# EAGLE design Adafruit MiniPOV4 Kit (EAGLE 6.3)
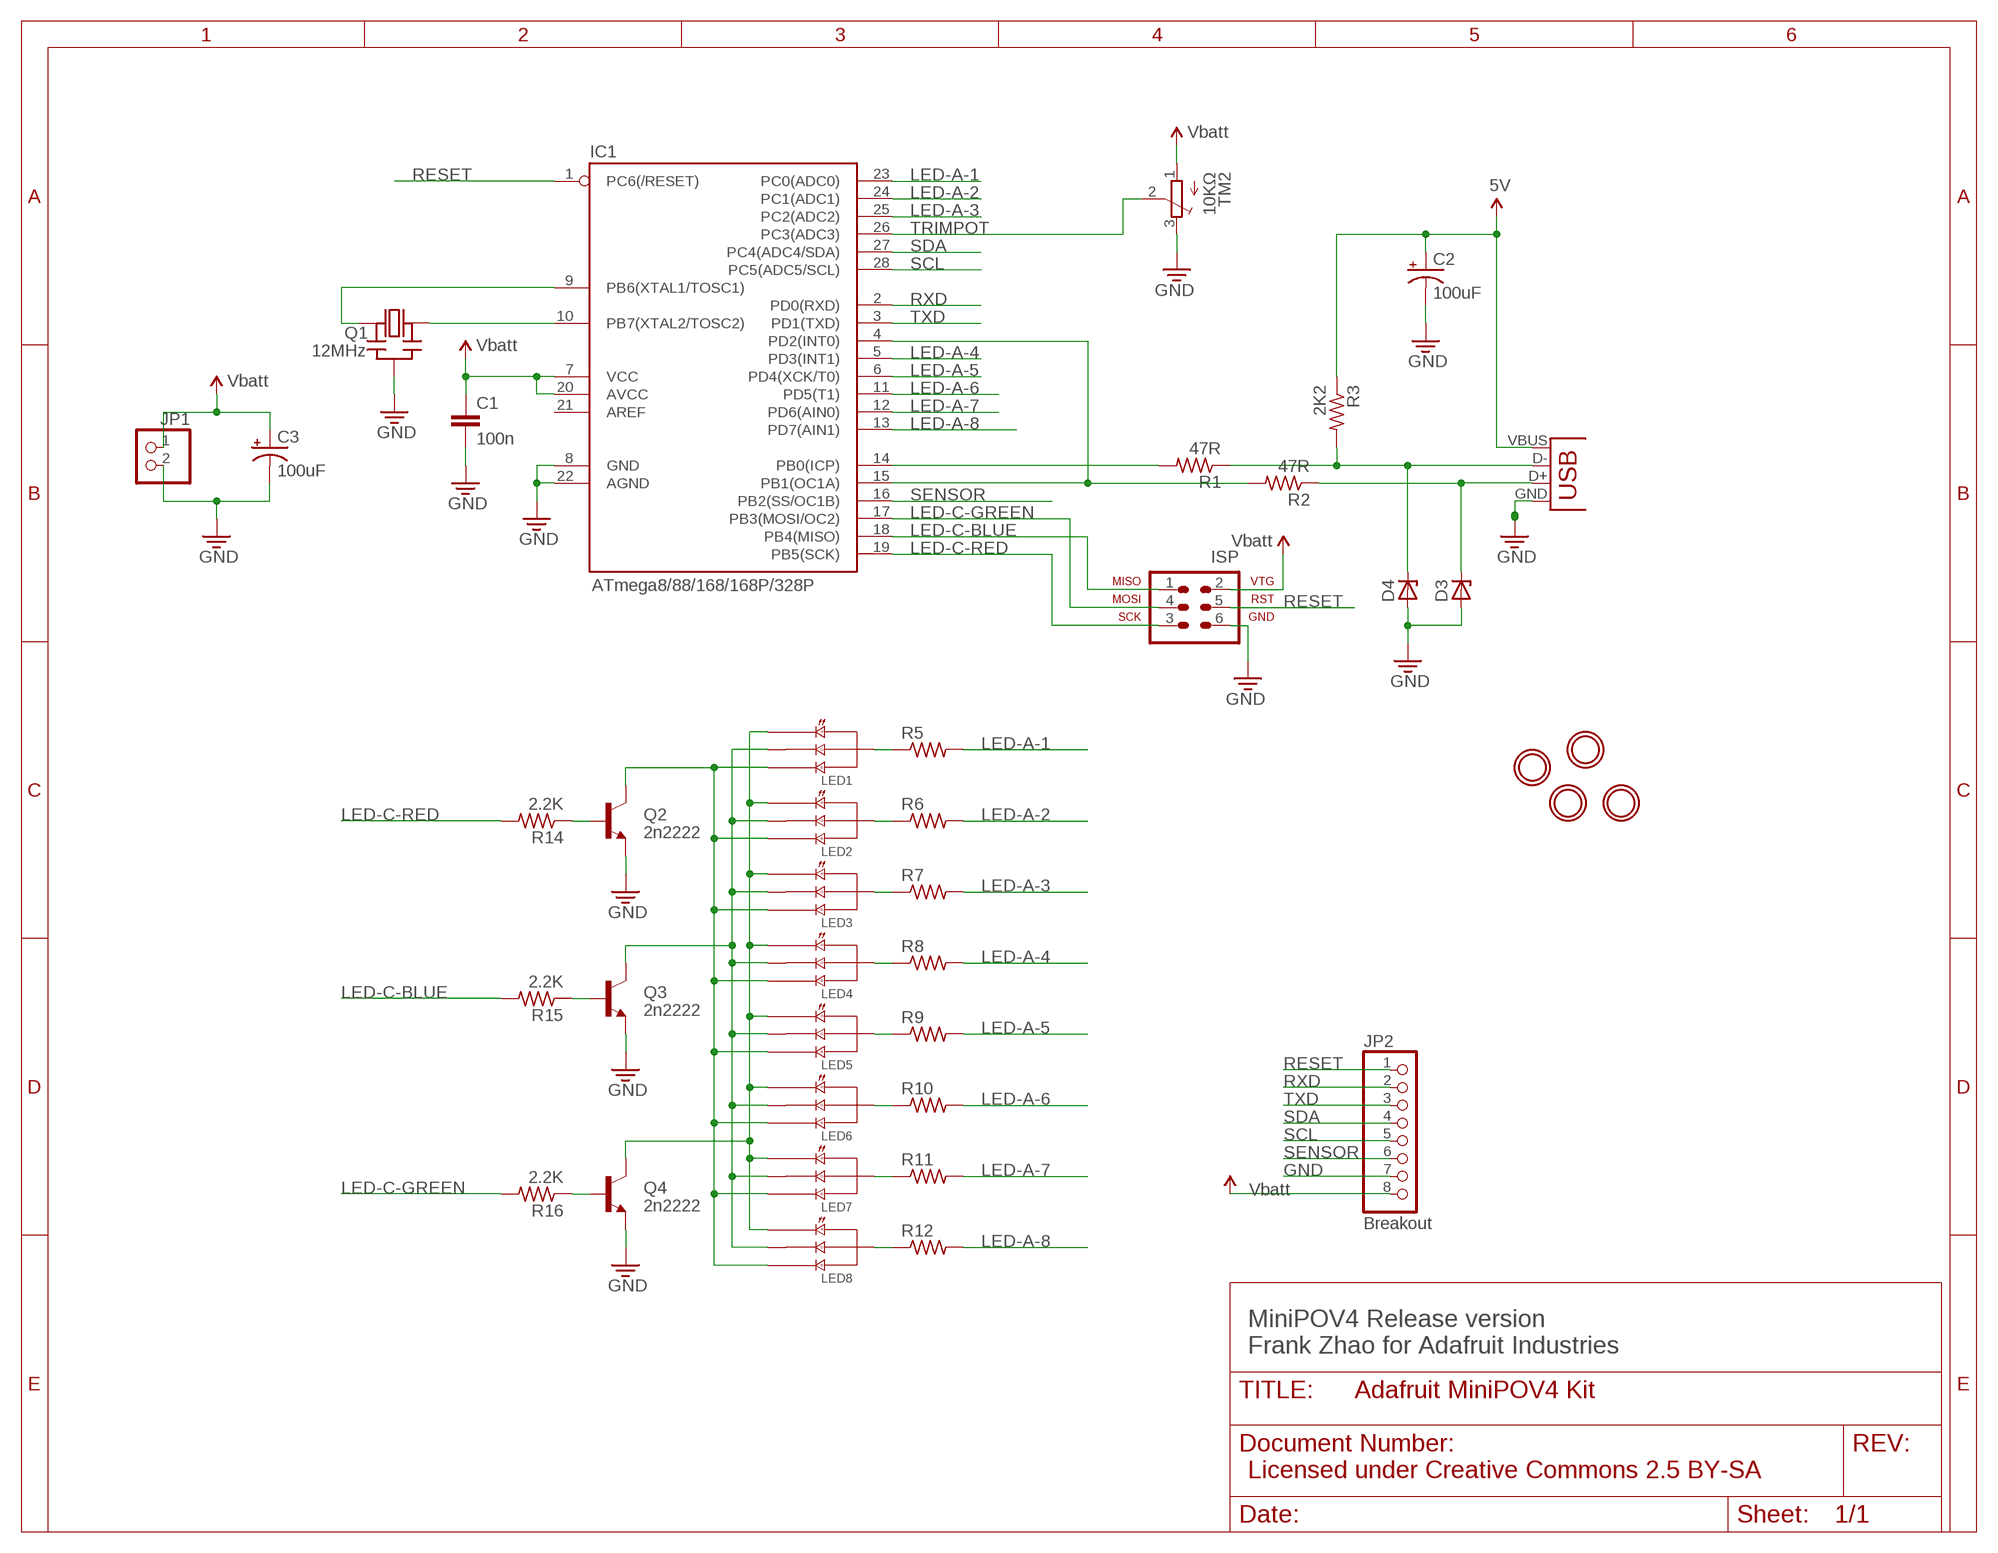
[diagram p0: schematic, sheet 1]

## Parts
C1  100n  CAPPTH2  [CAP-PTH-SMALL2]
C2  100uF  CPOL-USE2.5-6  [E2,5-6]
C3  100uF  CPOL-USE2.5-6  [E2,5-6]
D3  ZENER-DIODEDO34-7  [DO34Z7]
D4  ZENER-DIODEDO34-7  [DO34Z7]
IC1  ATmega8/88/168/168P/328P  AVR-MEGA8-PPTH  [DIL28-3]
ISP  AVR-ISP-6  [AVR-ISP-6]
JP1  HEADER-1X2  [1X02_OVAL]
JP2  Breakout  PINHD-1X8BIG  [1X08-BIG]
LED1  LED-RGB-CA-PIRANHA  [PIRANHA5MM]
LED2  LED-RGB-CA-PIRANHA  [PIRANHA5MM]
LED3  LED-RGB-CA-PIRANHA  [PIRANHA5MM]
LED4  LED-RGB-CA-PIRANHA  [PIRANHA5MM]
LED5  LED-RGB-CA-PIRANHA  [PIRANHA5MM]
LED6  LED-RGB-CA-PIRANHA  [PIRANHA5MM]
LED7  LED-RGB-CA-PIRANHA  [PIRANHA5MM]
LED8  LED-RGB-CA-PIRANHA  [PIRANHA5MM]
Q1  12MHz  CERMOSCILL  [CERM_OSC]
Q2  2n2222  TRANSISTOR_NPNTO92  [TO-92]
Q3  2n2222  TRANSISTOR_NPNTO92  [TO-92]
Q4  2n2222  TRANSISTOR_NPNTO92  [TO-92]
R1  47R  R-US_0207/9  [0207/9]
R2  47R  R-US_0207/9  [0207/9]
R3  2K2  R-US_0207/9  [0207/9]
R5  R-US_0207/9  [0207/9]
R6  R-US_0207/9  [0207/9]
R7  R-US_0207/9  [0207/9]
R8  R-US_0207/9  [0207/9]
R9  R-US_0207/9  [0207/9]
R10  R-US_0207/9  [0207/9]
R11  R-US_0207/9  [0207/9]
R12  R-US_0207/9  [0207/9]
R14  2.2K  R-US_0207/9  [0207/9]
R15  2.2K  R-US_0207/9  [0207/9]
R16  2.2K  R-US_0207/9  [0207/9]
TM2  10KΩ  TRIMPOT3386  [TRIM-3386]
U$2  MOUNTINGHOLE2.5_THICK  [MOUNTINGHOLE_2.5_PLATED_THICK]
U$3  MOUNTINGHOLE2.5_THICK  [MOUNTINGHOLE_2.5_PLATED_THICK]
U$4  MOUNTINGHOLE2.5_THICK  [MOUNTINGHOLE_2.5_PLATED_THICK]
U$5  MOUNTINGHOLE2.5_THICK  [MOUNTINGHOLE_2.5_PLATED_THICK]
USB  USBPTH  [USB-B-PTH]

## Nets
3.3V: C1.1 C3.+ IC1.7(VCC) IC1.20(AVCC) ISP.2(VTG) JP1.1 JP2.8 TM2.1(A) ; supply symbol labelled Vbatt
5V: C2.+ R3.1 USB.VBUS
GND: C1.2 C2.- C3.- D3.A D4.A IC1.8(GND) IC1.22(AGND) ISP.6(GND) JP1.2 JP2.7 Q1.G(GND) Q2.1(E) Q3.1(E) Q4.1(E) TM2.3(E) USB.GND USB.S1 USB.S2
LED-A-1: IC1.23(PC0(ADC0)) R5.2
LED-A-2: IC1.24(PC1(ADC1)) R6.2
LED-A-3: IC1.25(PC2(ADC2)) R7.2
LED-A-4: IC1.5(PD3(INT1)) R8.2
LED-A-5: IC1.6(PD4(XCK/T0)) R9.2
LED-A-6: IC1.11(PD5(T1)) R10.2
LED-A-7: IC1.12(PD6(AIN0)) R11.2
LED-A-8: IC1.13(PD7(AIN1)) R12.2
LED-C-BLUE: IC1.18(PB4(MISO)) ISP.1(MISO) R15.2
LED-C-GREEN: IC1.17(PB3(MOSI/OC2)) ISP.4(MOSI) R16.2
LED-C-RED: IC1.19(PB5(SCK)) ISP.3(SCK) R14.2
N$1: IC1.9(PB6(XTAL1/TOSC1)) Q1.1(IN)
N$2: IC1.10(PB7(XTAL2/TOSC2)) Q1.2(OUT)
N$3: D4.C R1.1 R3.2 USB.D-
N$4: D3.C R2.1 USB.D+
N$5: LED2.4(C) R6.1
N$6: LED1.4(C) R5.1
N$7: IC1.14(PB0(ICP)) R1.2
N$8: IC1.4(PD2(INT0)) IC1.15(PB1(OC1A)) R2.2
N$10: LED8.4(C) R12.1
N$11: LED7.4(C) R11.1
N$12: LED6.4(C) R10.1
N$13: LED5.4(C) R9.1
N$14: LED4.4(C) R8.1
N$15: LED3.4(C) R7.1
N$16: LED1.2(R) LED2.2(R) LED3.2(R) LED4.2(R) LED5.2(R) LED6.2(R) LED7.2(R) LED8.2(R) Q4.3(C)
N$17: LED1.3(G) LED2.3(G) LED3.3(G) LED4.3(G) LED5.3(G) LED6.3(G) LED7.3(G) LED8.3(G) Q3.3(C)
N$18: LED1.1(B) LED2.1(B) LED3.1(B) LED4.1(B) LED5.1(B) LED6.1(B) LED7.1(B) LED8.1(B) Q2.3(C)
N$19: Q2.2(B) R14.1
N$20: Q3.2(B) R15.1
N$21: Q4.2(B) R16.1
RESET: IC1.1(PC6(/RESET)) ISP.5(RST) JP2.1
RXD: IC1.2(PD0(RXD)) JP2.2
SCL: IC1.28(PC5(ADC5/SCL)) JP2.5
SDA: IC1.27(PC4(ADC4/SDA)) JP2.4
SENSOR: IC1.16(PB2(SS/OC1B)) JP2.6
TRIMPOT: IC1.26(PC3(ADC3)) TM2.2(S)
TXD: IC1.3(PD1(TXD)) JP2.3
Unconnected: IC1.21(AREF)

## Notes on the sheet
- MiniPOV4 Release version
  Frank Zhao for Adafruit Industries
- Licensed under Creative Commons 2.5 BY-SA

## Library data of the parts
C1 = minipov4:CAP: Capacitor Standard 0603 ceramic capacitor, and 0.1" leaded capacitor.
C2 C3 = rcl-ez:CPOL-US: POLARIZED CAPACITOR, American symbol
D3 D4 = diode:ZENER-DIODE: Z-Diode
IC1 = minipov4:AVR-MEGA8-P: MICROCONTROLLER 8 Kbytes FLASH 1 kbytes SRAM 512 bytes EEPROM USART 4-channel 10 bit ADC 2-channel 8 bit ADC
ISP = minipov4:AVR-ISP-6: AVR ISP-6 Serial Programming Header
JP1 = microbuilder:HEADER-1X2: PIN HEADER
JP2 = adafruit:PINHD-1X8: PIN HEADER
LED1-LED8 = minipov4:LED-RGB-CA
Q1 = minipov4:CERMOSCILL
Q2-Q4 = minipov4:TRANSISTOR_NPN: Transistor NPN BJT configuration in SOT23 package. MMBT2222 is the common NPN we use. Double check BCE configuration again layout.
R1-R3 R5-R12 R14-R16 = adafruit:R-US_: RESISTOR, American symbol
TM2 = adafruit:TRIMPOT: SMT trimmer potentiometer part number TC33X http://www.ladyada.net/library/eagle
U$2-U$5 = microbuilder:MOUNTINGHOLE: Mounting Hole For #2 screws (0.086"/2.18mm width, 0.094"/2.4mm hole) use 2.5mm
USB = minipov4:USB: USB Connectors USB-B-PTH is fully proven SKU : PRT-00139 USB-miniB is fully proven SKU : PRT-00587 USB-A-PCB is untested. USB-A-H is throughly reviewed, but untested. Spark Fun Electronics SKU : PRT-00437 USB-B-SMT is throughly reviewed, but untested. Needs silkscreen touching up. USB-A-S has not been used/tested USB-MB-H has not been used/tested

## Board
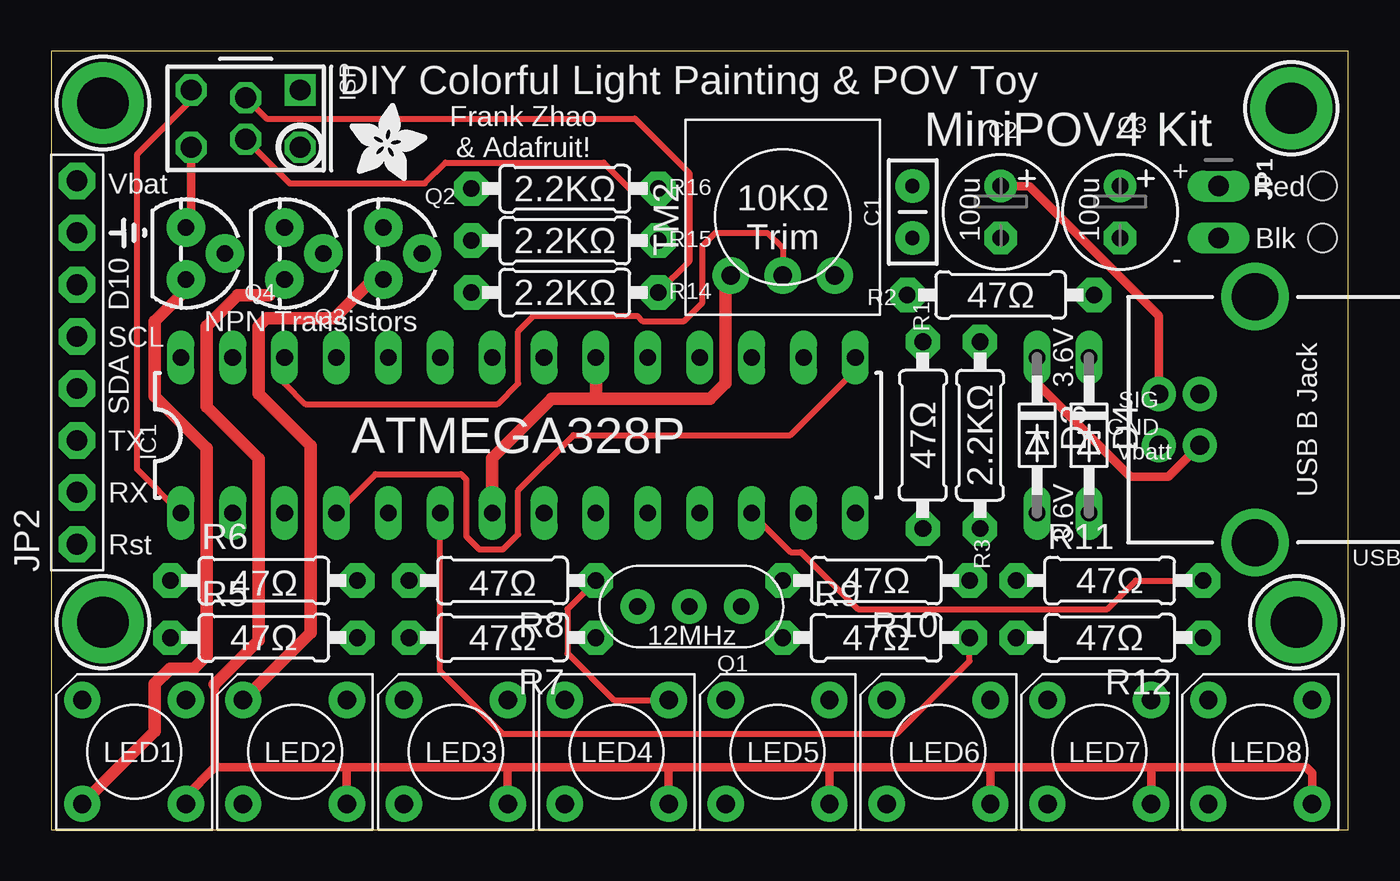
[diagram p1: board, top side]
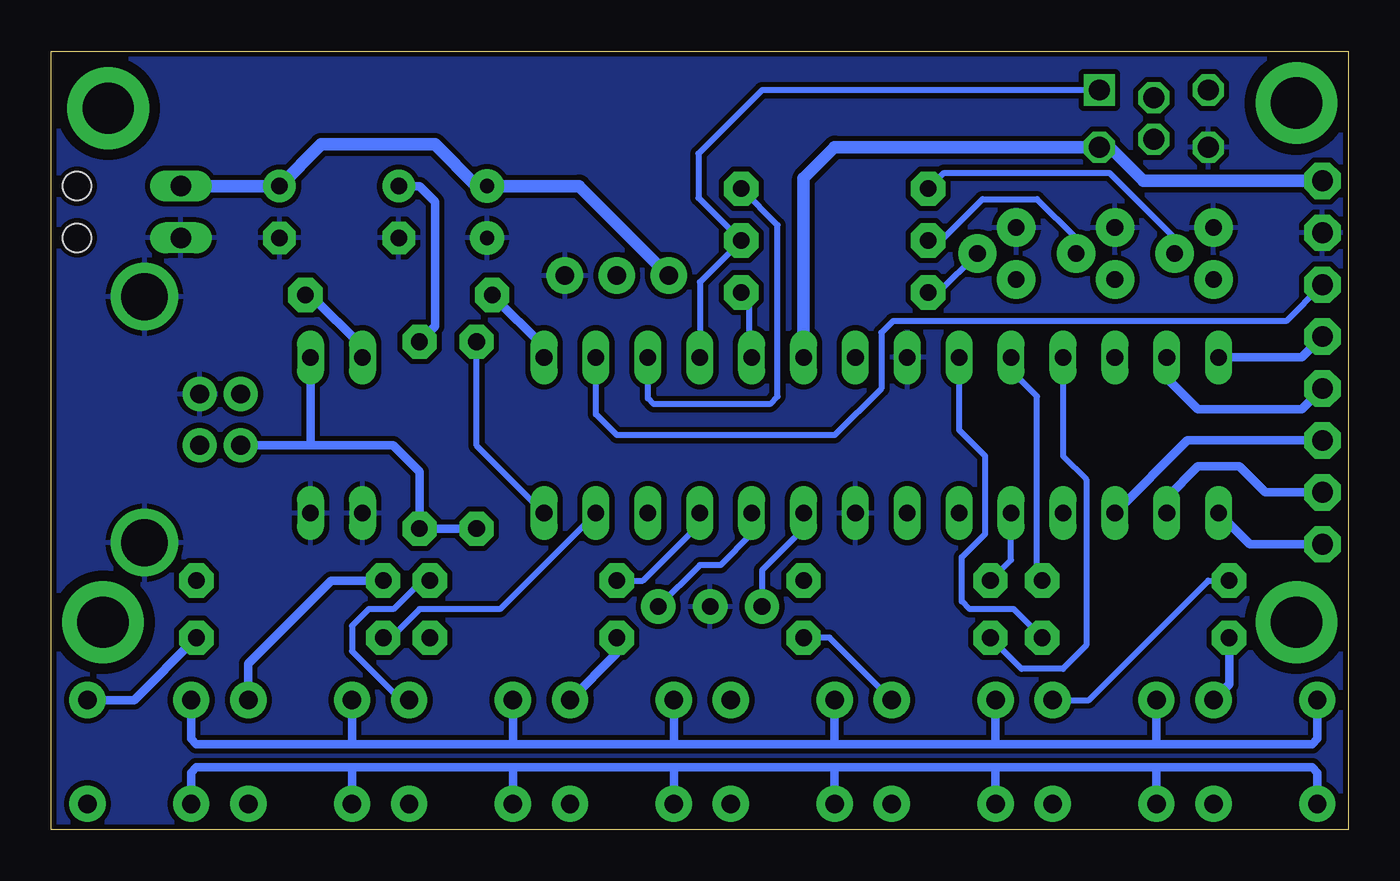
[diagram p2: board, bottom side, seen from below]

Size 63.5 x 38.1 mm. Coordinates in mm from the lower left corner, seen from the top.
Outline: 0,0 63.5,0 63.5,38.1 0,38.1 0,0
Copper layers (1*16): Top 0.035mm / dielectric 1.5mm / Bottom 0.035mm
Design rules "adafruit *": minimum track width 12mil, minimum drill 15.5mil, track to track 10mil, track to pad 10mil, pad to pad 16mil, via to via 10mil, smd to smd 8mil, copper to edge 10mil, drill to drill 8mil, minimum pad ring 10mil, minimum via ring 8mil, stop-mask expansion 4mil, vias tented up to drill 20mil, thermal gap 10mil
Holes 1.4 mm at 62.23,28.96 62.23,31.5

### Footprints (pad centres in the part's own frame; a part is rotated, then mirrored left to right if it is on the bottom)
CAP-PTH-SMALL2 = drill 0.7 pad 1.651: 1 0,0; 2 2.54,0
E2,5-6 = drill 0.813 pad 1.6: + -1.27,0 | drill 0.813 pad 1.6 octagon: - 1.27,0
DO34Z7 = drill 0.813 long: A 3.81,0; C -3.81,0
DIL28-3 = drill 0.813 long: 1 -16.51,-3.81; 2 -13.97,-3.81; 3 -11.43,-3.81; 4 -8.89,-3.81; 5 -6.35,-3.81; 6 -3.81,-3.81; 7 -1.27,-3.81; 8 1.27,-3.81; 9 3.81,-3.81; 10 6.35,-3.81; 11 8.89,-3.81; 12 11.43,-3.81; 13 13.97,-3.81; 14 16.51,-3.81; 15 16.51,3.81; 16 13.97,3.81; 17 11.43,3.81; 18 8.89,3.81; 19 6.35,3.81; 20 3.81,3.81; 21 1.27,3.81; 22 -1.27,3.81; 23 -3.81,3.81; 24 -6.35,3.81; 25 -8.89,3.81; 26 -11.43,3.81; 27 -13.97,3.81; 28 -16.51,3.81
AVR-ISP-6 = drill 1.016 square: 1 -2.667,-1.397 | drill 1.016 octagon: 2 -2.667,1.397; 3 0,-1.016; 4 0,1.016; 5 2.667,-1.397; 6 2.667,1.397
1X02_OVAL = drill 1 long: 1 -1.27,0; 2 1.27,0
1X08-BIG = drill 1.016 pad 1.778 octagon: 1 -8.89,0; 2 -6.35,0; 3 -3.81,0; 4 -1.27,0; 5 1.27,0; 6 3.81,0; 7 6.35,0; 8 8.89,0
PIRANHA5MM = drill 0.9 pad 1.778: 1 -2.54,2.54; 2 -2.54,-2.54; 3 2.54,-2.54; 4 2.54,2.54
CERM_OSC = drill 0.813 pad 1.676: 1 -2.54,0; 2 2.54,0; G 0,0
TO-92 = drill 0.813 pad 1.88: 1 -1.27,0; 2 0,1.905; 3 1.27,0
0207/9 = drill 0.813 pad 1.676 octagon: 1 -4.572,0; 2 4.572,0
TRIM-3386 = drill 0.9 pad 1.778: 1 -2.54,-2.857; 2 0,-2.857; 3 2.54,-2.857
MOUNTINGHOLE_2.5_PLATED_THICK = drill 2.5 pad 4: P$1 0,0
USB-B-PTH = drill 0.914 pad 1.676: D+ 2.7,1.25; D- 4.71,1.25; GND 2.7,-1.25; VBUS 4.71,-1.25 | drill 2.286: S1 0,-6.02; S2 0,6.02

### Placement (x,y rotation side)
C1  42.16,31.5 270 top
C2  46.48,30.23 270 top
C3  52.32,30.23 270 top
D3  48.26,19.3 270 top
D4  50.8,19.3 270 top
IC1  22.86,19.3 0 top
ISP  9.53,34.8 180 top
JP1  57.15,30.23 270 top
JP2  1.27,22.86 90 top
LED1  4.06,3.81 0 top
LED2  11.94,3.81 0 top
LED3  19.81,3.81 0 top
LED4  27.69,3.81 0 top
LED5  35.56,3.81 0 top
LED6  43.43,3.81 0 top
LED7  51.31,3.81 0 top
LED8  59.18,3.81 0 top
Q1  31.24,10.92 0 top
Q2  16.26,28.19 270 top
Q3  11.43,28.19 270 top
Q4  6.6,28.19 270 top
R1  42.67,19.3 90 top
R2  46.48,26.16 180 top
R3  45.47,19.3 270 top
R5  10.41,9.4 0 top
R6  10.41,12.19 0 top
R7  22.1,9.4 180 top
R8  22.1,12.19 180 top
R9  40.39,9.4 0 top
R10  40.39,12.19 180 top
R11  51.82,12.19 0 top
R12  51.82,9.4 180 top
R14  25.15,26.29 0 top
R15  25.15,28.83 0 top
R16  25.15,31.37 0 top
TM2  35.81,29.97 0 top
U$2  2.54,10.16 0 top
U$3  60.96,10.16 0 top
U$4  2.54,35.56 0 top
U$5  60.71,35.31 0 top
U$6  [ADAFRUIT_3.5MM]  14.61,31.75 0 top
USB  58.93,20.07 180 top

### Tracks (layer width: path | path; a pad name or v marks a point on that pad's centre or on a via)
3.3V
  Top 0.61: IC1.20 26.67,21.08 | 26.67,21.08 32.25,21.08 33.02,21.86 33.02,26.86 TM2.1 | IC1.7 21.59,18.19 24.49,21.08 26.67,21.08
  Bottom 0.61: JP1.1 C3.+ 50.28,33.54 44.71,33.54 42.67,31.5 C1.1 37.66,31.5 TM2.1 | JP2.8 10.03,31.75 11.68,33.4 ISP.2 25.15,33.4 26.67,31.88 IC1.20
5V
  Top 0.406: USB.VBUS 54.22,25.16 47.88,31.5 C2.+
  Bottom 0.406: R3.1 44.7,24.64 44.7,30.73 45.47,31.5 C2.+
GND
  Top 0.406: Q4.1 6.86,29.72 ISP.6
  pour Bottom (isolate 0.254): 0.25,-0.25 0.25,38.1 63.5,38.1 63.5,-0.25
LED-A-1
  Bottom 0.305: R5.2 16.38,10.79 18.54,10.79 18.92,11.18 18.92,13.34 17.78,14.48 17.78,18.29 19.05,19.56 IC1.23
LED-A-2
  Bottom 0.305: R6.2 15.24,12.45 15.24,21.21 16.51,22.48 IC1.24
LED-A-3
  Bottom 0.305: IC1.25 13.97,18.29 12.83,17.14 12.83,9.02 13.97,7.87 16,7.87 R7.2
LED-A-4
  Bottom 0.305: R8.2 16.51,13.21 IC1.5
LED-A-5
  Top 0.305: R9.2 44.96,8.26 41.4,4.7 22.1,4.7 19.05,7.75 IC1.6
LED-A-6
  Bottom 0.305: R10.2 34.53,12.19 31.75,14.98 IC1.11
LED-A-7
  Top 0.305: IC1.12 36.2,13.59 36.7,13.59 39.5,10.79 51.69,10.79 53.09,12.19 R11.2
LED-A-8
  Bottom 0.305: IC1.13 41.53,10.79 45.47,10.79 46.86,9.4 R12.2
LED-C-BLUE
  Bottom 0.305: ISP.1 28.7,36.2 31.81,33.09 31.81,30.92 R15.2 31.75,26.8 IC1.18
LED-C-GREEN
  Top 0.305: ISP.4 11.68,31.62 18.29,31.62 19.3,32.64 27.05,32.64 28.32,31.37 R16.2
  Bottom 0.305: IC1.17 34.29,21.11 34.01,20.83 28.32,20.83 27.94,21.21 27.94,29.59 R16.2
LED-C-RED
  Top 0.305: ISP.3 10.54,34.8 28.57,34.8 31.24,32.13 31.24,27.81 R14.2
  Bottom 0.305: R14.2 29.34,25.91 29.34,23.11 IC1.19
N$1
  Bottom 0.305: IC1.9 26.67,14.73 28.7,12.7 Q1.1
N$2
  Bottom 0.305: IC1.10 29.21,14.48 30.73,12.95 31.75,12.95 Q1.2
N$3
  Bottom 0.406: R1.1 R3.2 45.47,17.53 46.76,18.82 50.8,18.82 | USB.D- 50.8,18.82 | D4.C 50.8,18.82
N$4
  Top 0.406: USB.D+ 54.68,17.27 52.83,17.27 48.26,21.84 D3.C
  Bottom 0.406: R2.1 50.79,26.16 48.26,23.63 D3.C
N$5
  Bottom 0.305: LED2.4 12.7,6.35 6.86,12.19 R6.1
N$6
  Bottom 0.406: LED1.4 5.84,7.11 R5.1
N$7
  Bottom 0.305: IC1.14 42.67,18.8 R1.2
N$8
  Top 0.305: IC1.15 39.37,22.48 36.19,19.3 25.56,19.3 22.86,16.6 22.86,14.46 22.12,13.72 20.95,13.72 20.32,14.35 20.32,17.14 20.07,17.4 15.88,17.4 IC1.4
  Bottom 0.406: R2.2 39.37,23.62 IC1.15
N$10
  Bottom 0.406: R12.1 59.44,6.35 LED8.4
N$11
  Bottom 0.406: R11.1 49.78,12.19 53.85,8.13 LED7.4
N$12
  Bottom 0.305: LED6.4 46.37,6.35 48.77,8.75 48.77,9.98 47.95,10.79 46.74,10.79 45.34,12.19 R10.1
N$13
  Bottom 0.406: R9.1 35.81,8.64 LED5.4
N$14
  Top 0.305: R8.1 25.27,10.79 25.27,8.64 27.56,6.35 LED4.4
N$15
  Bottom 0.305: LED3.4 25.4,9.4 R7.1
N$16
  Top 0.61: LED1.2 5.08,4.83 5.08,7.13 5.82,7.87 6.99,7.87 7.62,8.51 7.62,18.67 5.08,21.21 5.08,24.89 6.6,26.42 Q4.3
  Bottom 0.406: 9.4,3.05 1.78,3.05 1.52,2.79 LED1.2 | LED2.2 9.4,3.05 | 9.4,3.05 17.27,3.05 | 25.15,3.05 17.53,3.05 17.27,3.05 | 25.15,3.05 33.02,3.05 | 33.02,3.05 40.89,3.05 | 40.89,3.05 48.77,3.05 | 48.77,3.05 56.39,3.05 56.64,2.79 LED8.2 | LED7.2 48.77,3.05 | LED6.2 40.89,3.05 | LED5.2 33.02,3.05 | LED4.2 25.15,3.05 | LED3.2 17.27,3.05
N$17
  Top 0.406: LED8.3 61.72,2.76 61.44,3.05 53.85,3.05 | 53.85,3.05 45.97,3.05 | 45.97,3.05 38.1,3.05 | 38.1,3.05 30.23,3.05 | 30.23,3.05 22.35,3.05 | 22.35,3.05 14.48,3.05 | 14.48,3.05 8,3.05 | 8,3.05 6.6,1.65 LED1.3 | LED2.3 14.48,3.05 | LED3.3 22.35,3.05 | LED4.3 30.23,3.05 | LED5.3 38.1,3.05 | LED6.3 45.97,3.05 | LED7.3 53.85,3.05 | 8,7.11 8,3.05
  Top 0.61: 8,7.11 10.16,9.27 10.16,18.16 7.62,20.7 7.62,24.64 9.14,26.16 10.67,26.16 Q3.3
N$18
  Top 0.61: LED2.1 12.7,9.65 12.7,18.8 10.16,21.34 10.16,24.64 10.54,25.02 13.84,25.02 15.75,26.92 Q2.3
  Bottom 0.406: LED8.1 56.64,4.45 56.39,4.19 48.77,4.19 | 48.77,4.19 40.89,4.19 | 40.89,4.19 33.02,4.19 | 33.02,4.19 25.15,4.19 | 25.15,4.19 17.27,4.19 | LED1.1 1.52,4.45 1.78,4.19 8.76,4.19 9.4,4.19 | LED3.1 17.27,4.19 | LED4.1 25.15,4.19 | LED5.1 33.02,4.19 | LED6.1 40.89,4.19 | LED7.1 48.77,4.19 | 17.27,4.19 9.4,4.19 | LED2.1 9.4,4.19
N$19
  Bottom 0.305: R14.1 20.07,26.29 Q2.2
N$20
  Bottom 0.305: R15.1 19.94,28.83 17.91,30.86 15.24,30.86 13.34,28.96 Q3.2
N$21
  Bottom 0.305: R16.1 19.8,32.15 11.7,32.15 8.51,28.96 Q4.2
RESET
  Top 0.305: ISP.5 6.86,35.69 4.19,33.02 4.19,17.65 IC1.1
  Bottom 0.406: JP2.1 4.83,13.97 IC1.1
RXD
  Bottom 0.406: JP2.2 4.06,16.51 5.33,17.78 7.37,17.78 8.89,16.26 IC1.2
SCL
  Bottom 0.406: JP2.5 2.29,23.11 IC1.28
SDA
  Bottom 0.406: JP2.4 2.29,20.57 7.37,20.57 8.89,22.1 IC1.27
SENSOR
  Bottom 0.305: JP2.6 3.05,24.89 22.29,24.89 22.86,24.32 22.86,21.59 25.15,19.3 35.81,19.3 36.83,20.33 IC1.16
TRIMPOT
  Top 0.305: IC1.26 11.43,21.84 12.45,20.83 21.84,20.83 22.86,21.84 22.86,24.38 23.62,25.15 28.7,25.15 28.96,24.89 30.99,24.89 31.88,25.78 31.88,28.57 32.51,29.21 35.05,29.21 35.81,28.45 TM2.2
TXD
  Bottom 0.406: JP2.3 7.87,19.05 IC1.3

### Text on the board
tPlace: DIY Colorful Light Painting & POV Toy | Frank Zhao / & Adafruit! | MiniPOV4 Kit | Vbat | + | 2.2KΩ | Red | 10KΩ / Trim | 100u | 100u | 2.2KΩ | Blk | - | 2.2KΩ | 47Ω | D10 | NPN Transistors | SCL | 3.6V | SDA | USB B Jack | TX | ATMEGA328P | 47Ω | 2.2KΩ | RX | 3.6V | Rst | 47Ω | 47Ω | 47Ω | 47Ω | 12MHz | 47Ω | 47Ω | 47Ω | 47Ω | LED1 | LED2 | LED3 | LED4 | LED5 | LED6 | LED7 | LED8
tNames: SIG | GND | Vbatt